# EAGLE design OpenEVSE_PLUS_v2 (EAGLE 6.2)
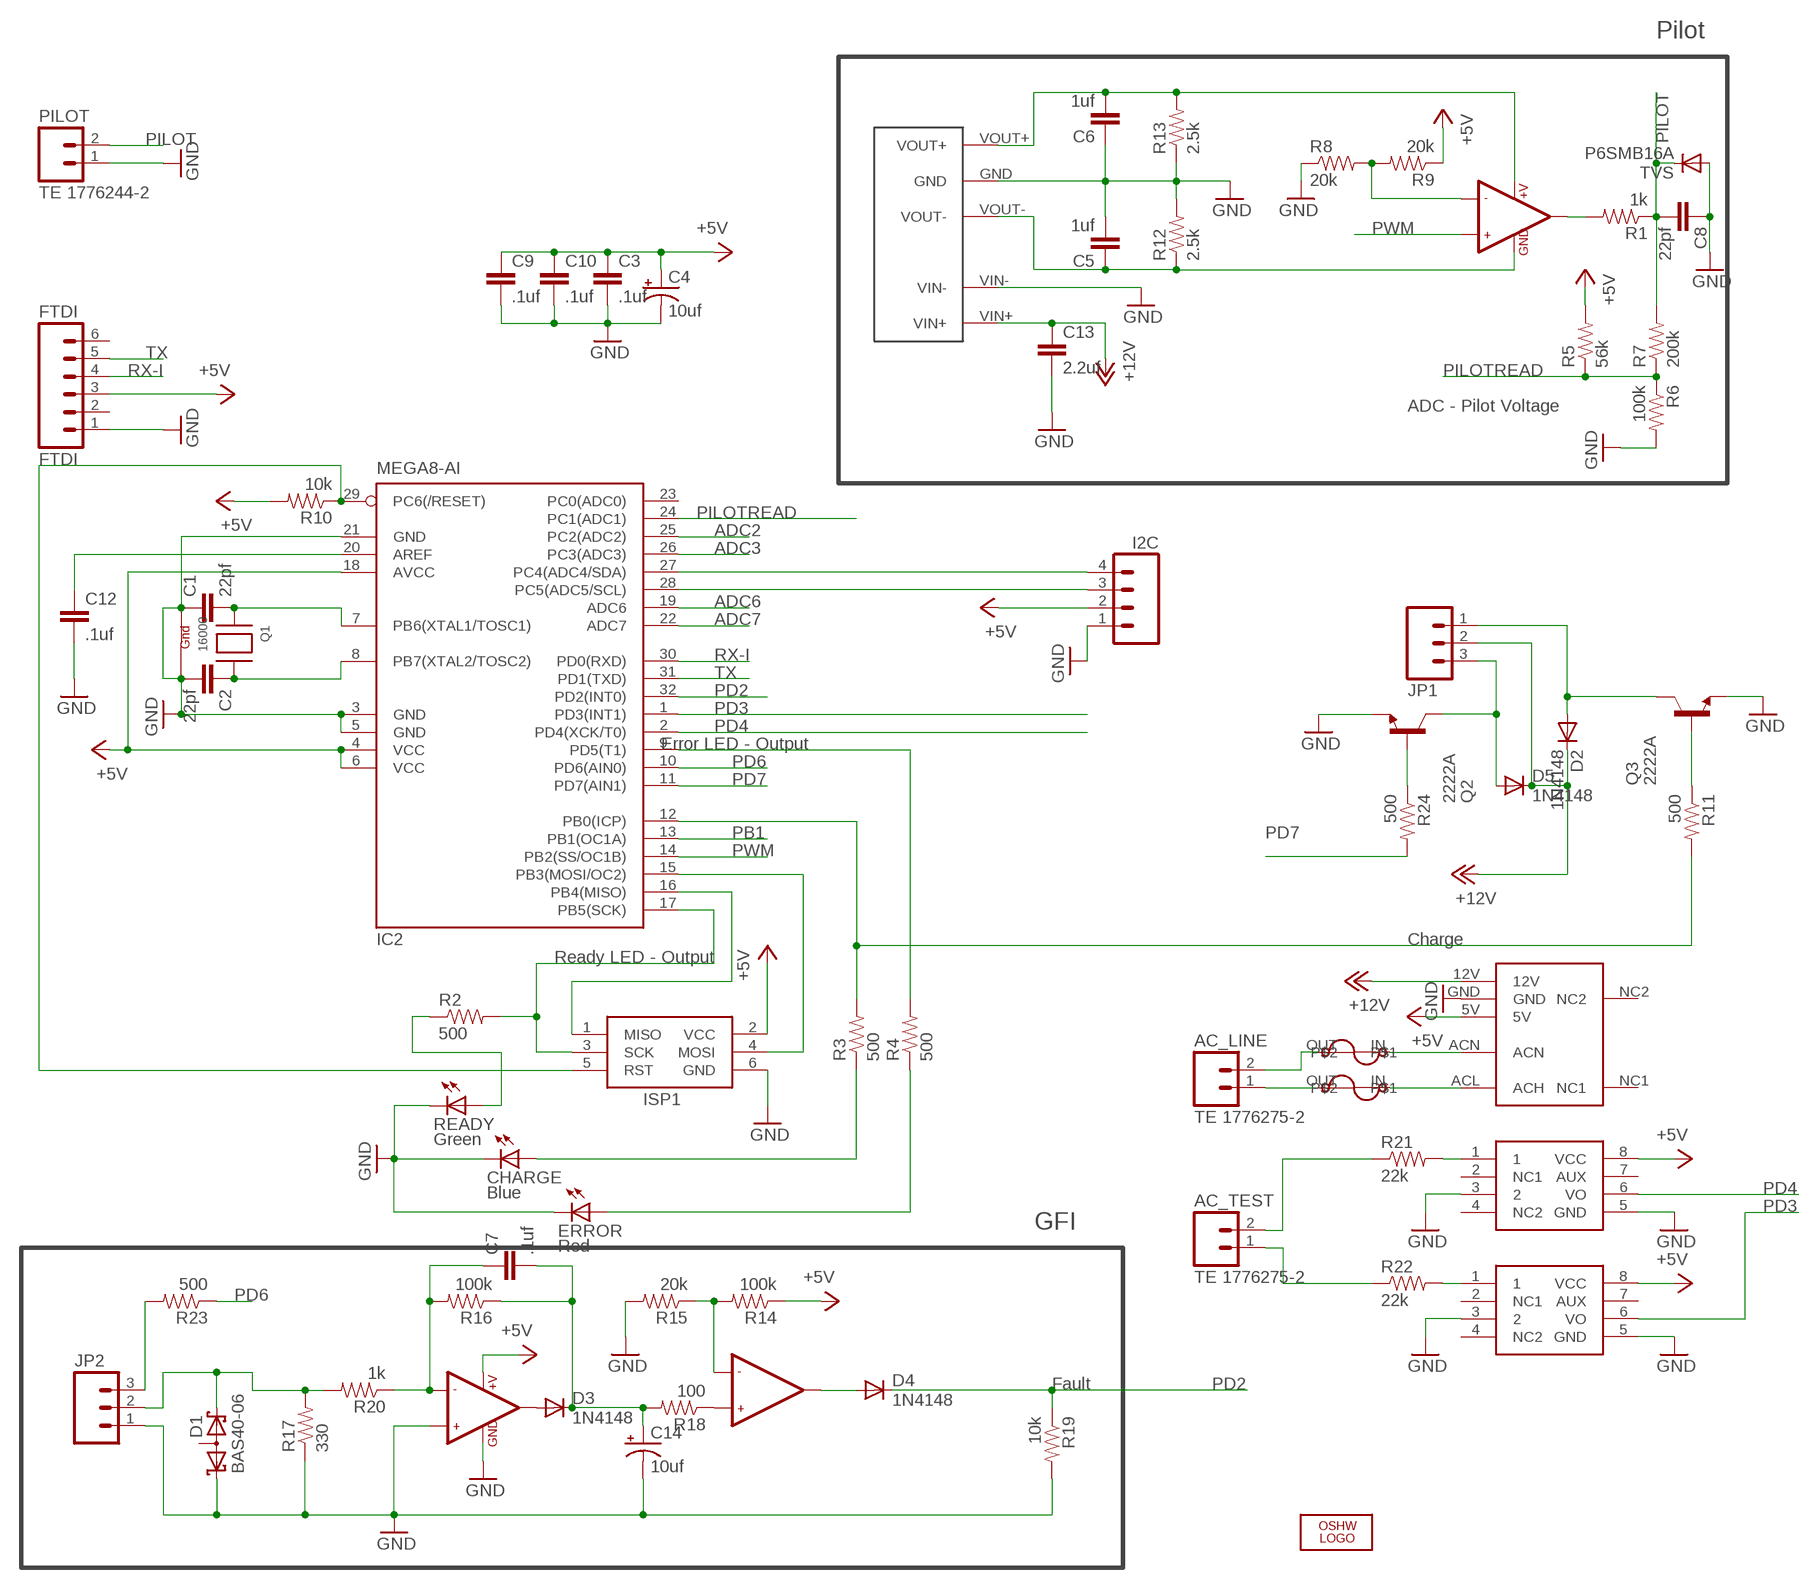
[diagram p0: schematic, sheet 1]

## Parts
AC_LINE  TE 1776275-2  M023.5MM_LOCK  [SCREWTERMINAL-3.5MM-2_LOCK]
AC_TEST  TE 1776275-2  M023.5MM_LOCK  [SCREWTERMINAL-3.5MM-2_LOCK]
C1  22pf  CAP0805  [0805]
C2  22pf  CAP0805  [0805]
C3  .1uf  CAP0805  [0805]
C4  10uf  CAP_POL1206  [EIA3216]
C5  1uf  CAP0805  [0805]
C6  1uf  CAP0805  [0805]
C7  .1uf  CAP0805  [0805]
C8  22pf  CAP0805  [0805]
C9  .1uf  CAP0805  [0805]
C10  .1uf  CAP0805  [0805]
C12  .1uf  CAP0805  [0805]
C13  2.2uf  CAP0805  [0805]
C14  10uf  CAP_POL1206  [EIA3216]
CHARGE  Blue  LED0603  [LED-0603]
D1  BAS40-06  [SOT23]
D2  1N4148  DIODE-SOD123  [SOD123]
D3  1N4148  DIODE-SOD123  [SOD123]
D4  1N4148  DIODE-SOD123  [SOD123]
D5  1N4148  DIODE-SOD123  [SOD123]
DCDC  D107E  DCDC_SIP  [DCDC_SIP]
ERROR  Red  LED0603  [LED-0603]
FTDI  FTDI  M06LOCK  [1X06_LOCK]
I2C  M04LOCK  [1X04_LOCK]
IC1  MID400  [DIP08]
IC2  MEGA8-AI  [TQFP32-08]
IC3  LMV358  [SO08]
IC4  LMV358  [SO08]
IC5  MID400  [DIP08]
ISP1  AVRISP-6  [AVRISP]
JP1  M03SCREW_LOCK  [SCREWTERMINAL-3.5MM-3_LOCK.007S]
JP2  M03LOCK  [1X03_LOCK]
LOGO1  OSHW_LOGO_8MILX0150-NT  [OSHW_8X150_NOTEXT]
PILOT  TE 1776244-2  M025MM  [SCREWTERMINAL-5MM-2]
Q1  16000  XTAL-4-3225  [NX3225]
Q2  2222A  BCX70SMD  [SOT23]
Q3  2222A  BCX70SMD  [SOT23]
R1  1k  RESISTOR0805-RES  [0805]
R2  500  RESISTOR0805-RES  [0805]
R3  500  RESISTOR0805-RES  [0805]
R4  500  RESISTOR0805-RES  [0805]
R5  56k  RESISTOR0805-RES  [0805]
R6  100k  RESISTOR0805-RES  [0805]
R7  200k  RESISTOR0805-RES  [0805]
R8  20k  RESISTOR0805-RES  [0805]
R9  20k  RESISTOR0805-RES  [0805]
R10  10k  RESISTOR0805-RES  [0805]
R11  500  RESISTOR0805-RES  [0805]
R12  2.5k  RESISTOR0805-RES  [0805]
R13  2.5k  RESISTOR0805-RES  [0805]
R14  100k  RESISTOR0805-RES  [0805]
R15  20k  RESISTOR0805-RES  [0805]
R16  100k  RESISTOR0805-RES  [0805]
R17  330  RESISTOR0805-RES  [0805]
R18  100  RESISTOR0805-RES  [0805]
R19  10k  RESISTOR0805-RES  [0805]
R20  1k  RESISTOR0805-RES  [0805]
R21  22k  RESISTORPTH-1/4W  [AXIAL-0.4]
R22  22k  RESISTORPTH-1/4W  [AXIAL-0.4]
R23  500  RESISTOR0805-RES  [0805]
R24  500  RESISTOR0805-RES  [0805]
READY  Green  LED0603  [LED-0603]
TVS  P6SMB16A  DIODE-SMB  [SMB]
U$1  MPM-04E-1205  [MPM-04E-1205]
U$2  BEL1AFUSE  [BELFUSE1A]
U$5  BEL1AFUSE  [BELFUSE1A]

## Nets
12V: C6.2 DCDC.VOUT+ IC4.8(+V) R13.2
+5V: C3.1 C4.A(+) C9.1 C10.1 FTDI.3 I2C.2 IC1.8(VCC) IC2.4(VCC) IC2.6(VCC) IC2.18(AVCC) IC3.8(+V) IC5.8(VCC) ISP1.2(VCC) R5.2 R9.1 R10.2 R14.1 U$1.5V
+12V: C13.1 D2.C D5.C DCDC.VIN+ JP1.2 U$1.12V
-12V: C5.1 DCDC.VOUT- IC4.4(GND) R12.1
ADC2: IC2.25(PC2(ADC2))
ADC3: IC2.26(PC3(ADC3))
ADC6: IC2.19(ADC6)
ADC7: IC2.22(ADC7)
GND: C1.1 C2.2 C3.2 C4.C(-) C5.2 C6.1 C8.1 C9.2 C10.2 C12.2 C13.2 C14.C(-) CHARGE.C D1.1(K1) DCDC.GND DCDC.VIN- ERROR.C FTDI.1 I2C.1 IC1.3 IC1.5(GND) IC2.3(GND) IC2.5(GND) IC2.21(GND) IC3.3(+IN1) IC3.4(GND) IC5.3 IC5.5(GND) ISP1.6(GND) JP2.1 PILOT.1 Q1.1(G1) Q1.3(G2) Q2.2(E) Q3.2(E) R6.2 R8.1 R12.2 R13.1 R15.2 R17.1 R19.2 READY.C TVS.A U$1.GND
N$1: ERROR.A R4.1
N$2: Q3.1(B) R11.1
N$4: C1.2 IC2.7(PB6(XTAL1/TOSC1)) Q1.2(X1)
N$5: C2.1 IC2.8(PB7(XTAL2/TOSC2)) Q1.4(X2)
N$6: CHARGE.A R3.1
N$7: U$1.ACL(ACH) U$2.IN
N$8: C7.1 IC3.2(-IN1) R16.2 R20.1
N$9: U$1.ACN U$5.IN
N$10: IC4.2(-IN1) R8.2 R9.2
N$11: IC4.1(OUT1) R1.2
N$12: AC_LINE.1 U$2.OUT
N$13: AC_LINE.2 U$5.OUT
N$14: IC2.15(PB3(MOSI/OC2)) ISP1.4(MOSI)
N$15: IC2.17(PB5(SCK)) ISP1.3(SCK) R2.2
N$16: IC2.16(PB4(MISO)) ISP1.1(MISO)
N$17: R2.1 READY.A
N$18: IC1.1 R21.P$2
N$19: IC5.1 R22.P$2
N$20: D1.2(K2) JP2.2 R17.2 R20.2
N$21: D3.A IC3.1(OUT1)
N$22: JP2.3 R23.2
N$23: C7.2 C14.A(+) D3.C R16.1 R18.2
N$24: IC3.6(-IN2) R14.2 R15.1
N$25: D4.A IC3.7(OUT2)
N$26: IC3.5(+IN2) R18.1
N$27: D5.A JP1.3 Q2.3(C)
N$28: AC_TEST.2 R21.P$1
N$29: AC_TEST.1 R22.P$1
N$30: Q2.1(B) R24.1
N$34: IC2.12(PB0(ICP)) R3.2 R11.2
N$36: IC2.9(PD5(T1)) R4.2
N$39: I2C.4 IC2.27(PC4(ADC4/SDA))
N$40: I2C.3 IC2.28(PC5(ADC5/SCL))
N$44: C12.1 IC2.20(AREF)
PB1: IC2.13(PB1(OC1A))
PD2: D4.C IC2.32(PD2(INT0)) R19.1
PD3: IC2.1(PD3(INT1)) IC5.6(VO)
PD4: IC1.6(VO) IC2.2(PD4(XCK/T0))
PD6: IC2.10(PD6(AIN0)) R23.1
PD7: IC2.11(PD7(AIN1)) R24.2
PILOT: C8.2 PILOT.2 R1.1 R7.2 TVS.C
PILOTREAD: IC2.24(PC1(ADC1)) R5.1 R6.1 R7.1
PWM: IC2.14(PB2(SS/OC1B)) IC4.3(+IN1)
RELAY: D2.A JP1.1 Q3.3(C)
RST: IC2.29(PC6(/RESET)) ISP1.5(RST) R10.1
RX-I: FTDI.4 IC2.30(PD0(RXD))
TX: FTDI.5 IC2.31(PD1(TXD))
Unconnected: D1.3(AA) FTDI.2 FTDI.6 IC1.2(NC1) IC1.4(NC2) IC1.7(AUX) IC2.23(PC0(ADC0)) IC4.5(+IN2) IC4.6(-IN2) IC4.7(OUT2) IC5.2(NC1) IC5.4(NC2) IC5.7(AUX) U$1.NC1 U$1.NC2

## Notes on the sheet
- Pilot
- ADC - Pilot Voltage
- Error LED - Output
- Charge
- Ready LED - Output
- GFI
- Fault

## Library data of the parts
AC_LINE AC_TEST PILOT = SparkFun:M02: Header 2 Standard 2-pin 0.1" header. Use with straight break away headers (SKU : PRT-00116), right angle break away headers (PRT-00553), swiss pins (PRT-00743), machine pins (PRT-00117), and female headers (PRT-00115). Molex polarized connector foot print use with SKU : PRT-08233 with associated crimp pins and housings.
C1-C3 C5-C10 C12 C13 = SparkFun:CAP: Capacitor Standard 0603 ceramic capacitor, and 0.1" leaded capacitor.
C4 C14 = SparkFun:CAP_POL: Capacitor Polarized These are standard SMD and PTH capacitors. Normally 10uF, 47uF, and 100uF in electrolytic and tantalum varieties. Always verify the external diameter of the through hole cap, it varies with capacity, voltage, and manufacturer. The EIA devices should be standard.
CHARGE ERROR READY = SparkFun:LED: LEDs Standard schematic elements and footprints for 5mm, 3mm, 1206, and 0603 sized LEDs. 5mm - Spark Fun Electronics SKU : COM-00529 (and others)
D1 = diode:BAS40-06: Silicon Schottky Diodes General-purpose diode for high-speed switching
D2-D5 TVS = diode:DIODE-: DIODE
DCDC = Qxd:DCDC_SIP
FTDI = SparkFun:M06: Header 6 Standard 6-pin 0.1" header. Use with straight break away headers (SKU : PRT-00116), right angle break away headers (PRT-00553), swiss pins (PRT-00743), machine pins (PRT-00117), and female headers (PRT-00115). Molex polarized connector foot print use with SKU : PRT-08094 with associated crimp pins and housings. NOTES ON THE VARIANTS LOCK and LOCK_LONGPADS... This footprint was designed to help hold the alignment of a through-hole component (i.e. 6-pin header) while soldering it into place. You may notice that each hole has been shifted either up or down by 0.005 of an inch from it's more standard position (which is a perfectly straight line). This slight alteration caused the pins (the squares in the middle) to touch the edges of the holes. Because they are alternating, it causes a "brace" to hold the component in place. 0.005 has proven to be the perfect amount of "off-center" position when using our standard breakaway headers. Although looks a little odd when you look at the bare footprint, once you have a header in there, the alteration is very hard to notice. Also, if you push a header all the way into place, it is covered up entirely on the bottom side. This idea of altering the position of holes to aid alignment will be further integrated into the Sparkfun Library for other footprints. It can help hold any component with 3 or more connection pins.
I2C = SparkFun:M04: Header 4 Standard 4-pin 0.1" header. Use with straight break away headers (SKU : PRT-00116), right angle break away headers (PRT-00553), swiss pins (PRT-00743), machine pins (PRT-00117), and female headers (PRT-00115). Molex polarized connector foot print use with SKU : PRT-08231 with associated crimp pins and housings.
IC1 IC5 = SparkFun:MID400
IC2 = atmel:MEGA8: MICROCONTROLLER 8 Kbytes FLASH, 1 kbytes SRAM, 512 bytes EEPROM, USART, 6-channel 10 bit ADC, 2-channel 8 bit ADC Pin compatible with Atmega48, ATMega88, ATMega168 Source: avr.lbr; MPN: ATMEGA8-16AU; OC_FARNELL: 9171371; OC_NEWARK: 73M8863
IC3 IC4 = SparkFun:LMV358
ISP1 = adafruit:AVRISP: AVR ISP HEADER Standard 6 pin header for AVR programming
JP1 JP2 = SparkFun:M03: Header 3 Standard 3-pin 0.1" header. Use with straight break away headers (SKU : PRT-00116), right angle break away headers (PRT-00553), swiss pins (PRT-00743), machine pins (PRT-00117), and female headers (PRT-00115). Molex polarized connector foot print use with SKU : PRT-08232 with associated crimp pins and housings.
LOGO1 = ohw-logo:OSHW_LOGO_8MIL
Q1 = adafruit:XTAL-4: Classic 4-pin 3.2 x 2.5mm crystal
Q2 Q3 = transistor-npn:BCX70*: NPN Transistor
R1-R24 = SparkFun:RESISTOR: Resistor Basic schematic elements and footprints for 0603, 1206, and PTH resistors.
U$1 = Qxd:MPM-04E-1205
U$2 U$5 = Qxd:BEL1AFUSE

## Board
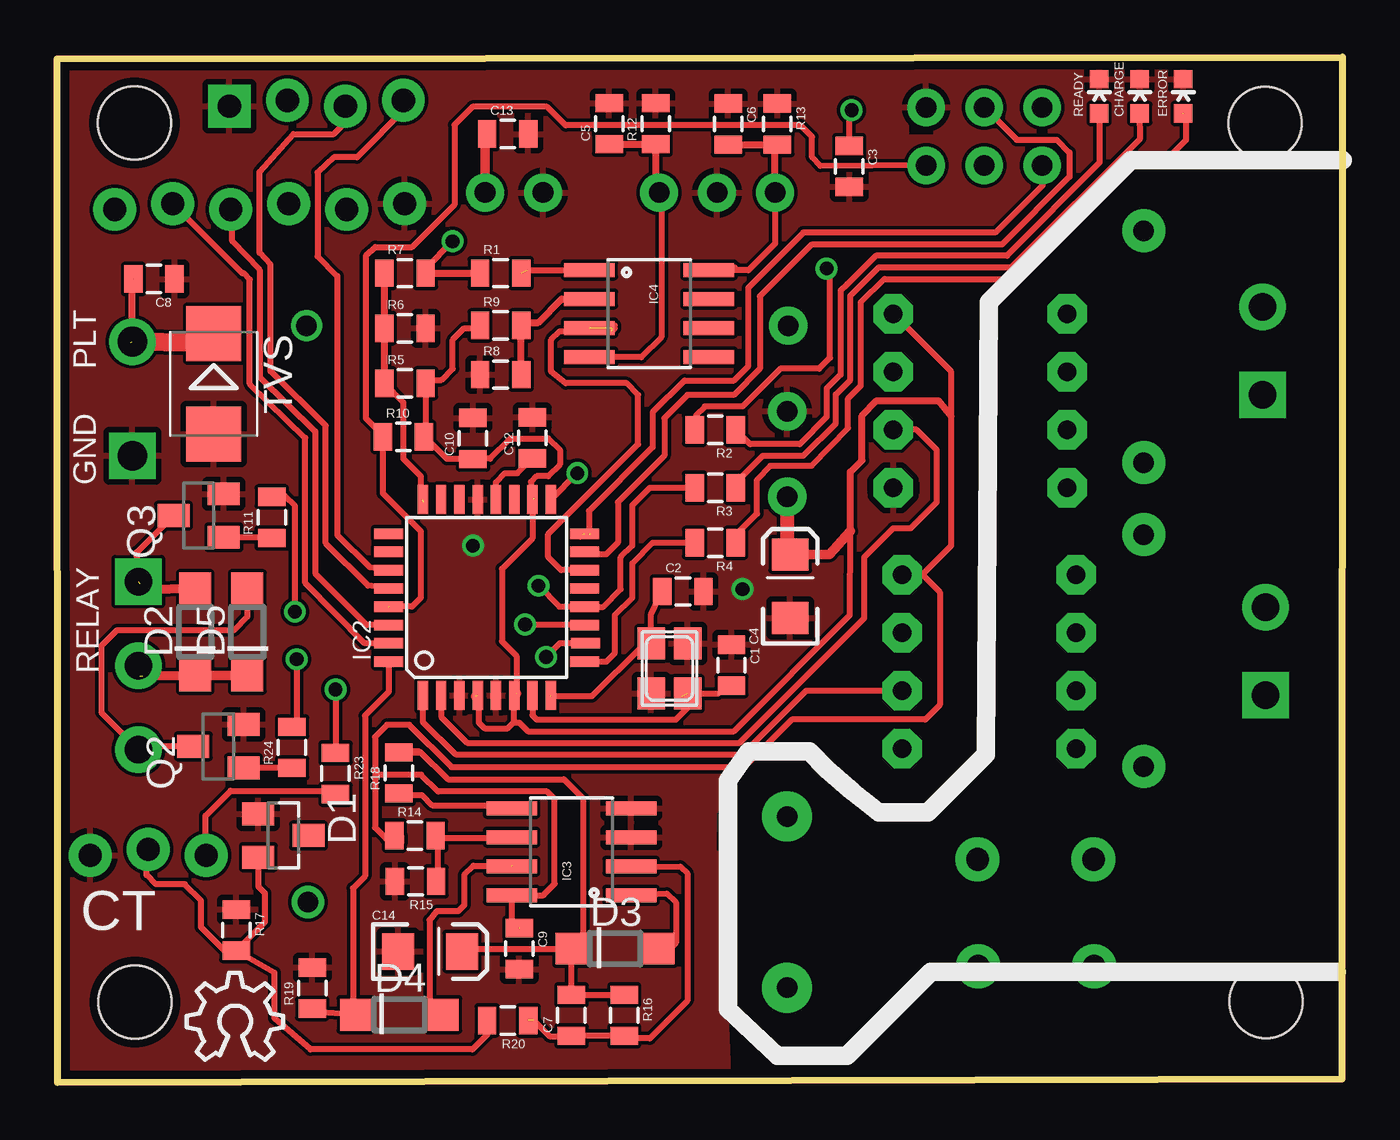
[diagram p1: board, top side]
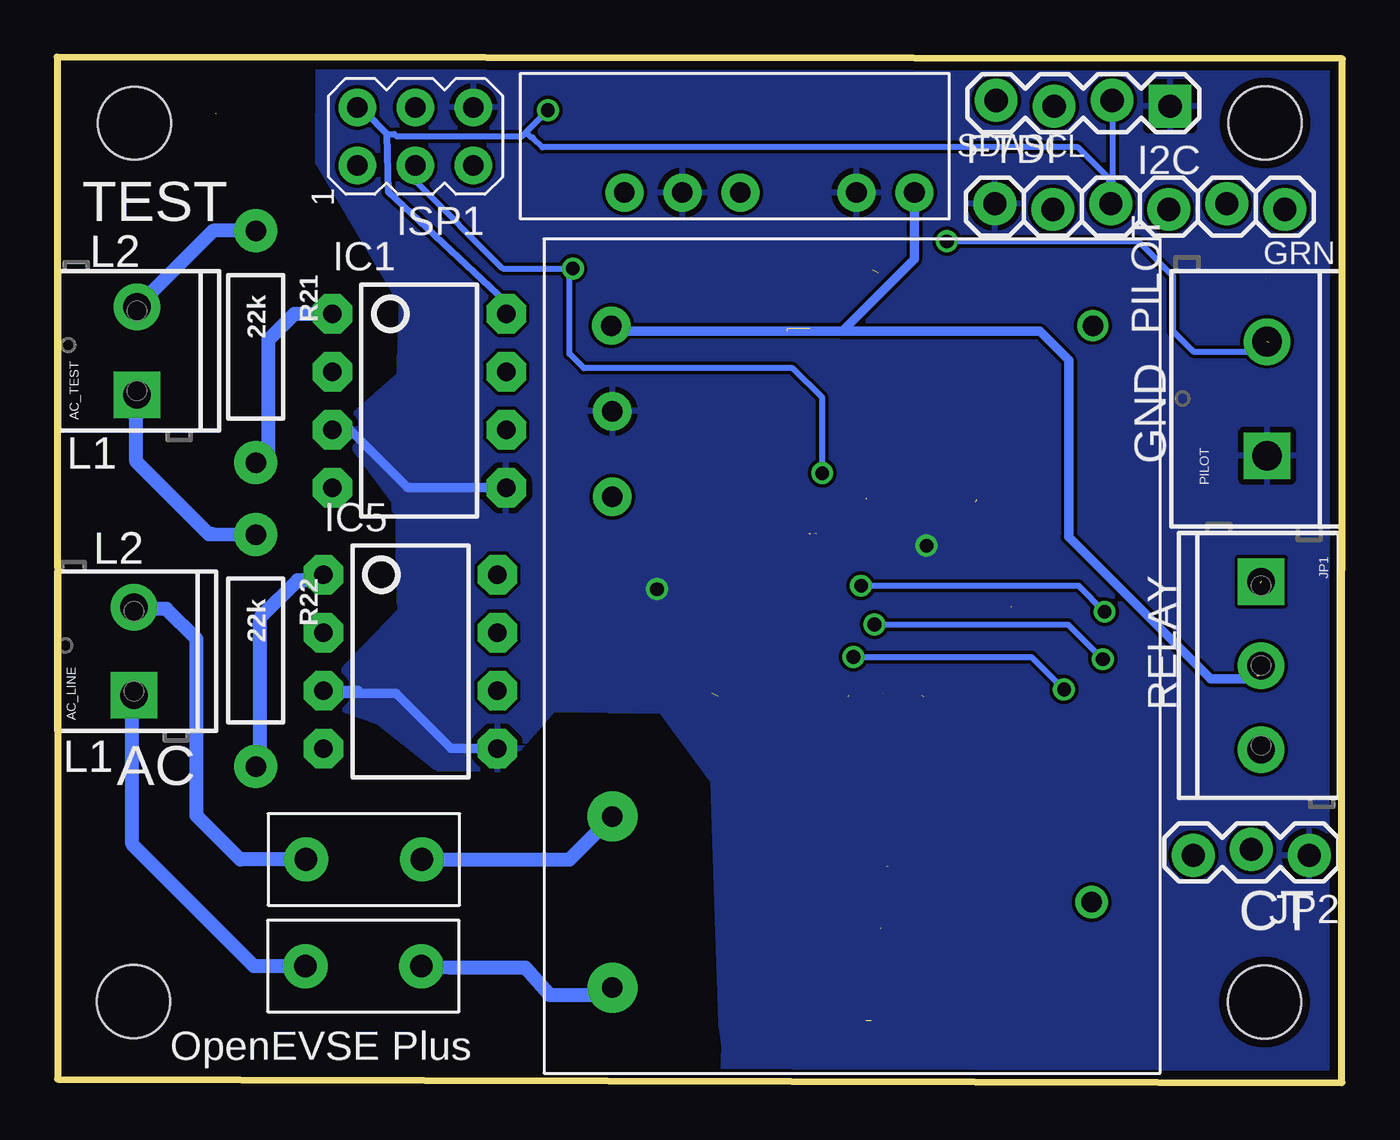
[diagram p2: board, bottom side, seen from below]

Size 56.31 x 44.93 mm. Coordinates in mm from the lower left corner, seen from the top.
Outline: 56.31,44.93 56.28,0.15 0.02,0 0,44.85 56.31,44.93
Copper layers (1*16): Top 0.0356mm / dielectric 1.5011mm / Bottom 0.0356mm
Design rules: minimum track width 6mil, minimum drill 13mil, track to track 6mil, track to pad 6mil, pad to pad 6mil, via to via 6mil, smd to smd 6mil, copper to edge 15mil, drill to drill 6mil, minimum pad ring 7mil, minimum via ring 7mil, stop-mask expansion 4mil, vias tented up to drill 0mil, thermal gap 10mil
Holes 3.2 mm at 52.91,42.03 52.97,3.55 3.41,3.53 3.38,42.04
tRestrict: area 35.5,25.8 to 36.4,26.4; area 36.9,25.8 to 37.8,26.3; area 37.3,41.6 to 38.4,42.3
bRestrict: area 35.5,25.7 to 36.3,26.3; area 37,25.6 to 37.8,26.3; area 37.6,41.5 to 38.7,42.3

### Footprints (pad centres in the part's own frame; a part is rotated, then mirrored left to right if it is on the bottom)
SCREWTERMINAL-3.5MM-2_LOCK = drill 1.2 pad 2.032 square: 1 -0.178,0 | drill 1.2 pad 2.032: 2 3.678,0
0805 = smd 0.8 x 1.2: 1 -0.9,0; 2 0.9,0
EIA3216 = smd 1.4 x 1.6: A 1.4,0; C -1.4,0
LED-0603 = smd 0.8 x 0.8: A 0,-0.75; C 0,0.75
SOT23 = smd 1 x 1.4: 1 -0.95,-1.1; 2 0.95,-1.1; 3 0,1.1
SOD123 = smd 1.4 x 1.4: A 1.9,0; C -1.9,0
DCDC_SIP = drill 0.9 pad 1.676: GND 10.16,0; VIN+ 0,0; VIN- 2.54,0; VOUT+ 12.7,0; VOUT- 7.62,0
1X06_LOCK = drill 1.016 pad 1.88: 1 0,0; 2 2.54,-0.254; 3 5.08,0; 4 7.62,-0.254; 5 10.16,0; 6 12.7,-0.254
1X04_LOCK = drill 1.016 pad 1.88 square: 1 0,0.127 | drill 1.016 pad 1.88: 2 2.54,-0.127; 3 5.08,0.127; 4 7.62,-0.127
DIP08 = drill 0.813 pad 1.727 octagon: 1 -3.81,-3.81; 2 -1.27,-3.81; 3 1.27,-3.81; 4 3.81,-3.81; 5 3.81,3.81; 6 1.27,3.81; 7 -1.27,3.81; 8 -3.81,3.81
TQFP32-08 = smd 1.27 x 0.457: 1 -4.293,2.8; 2 -4.293,2; 3 -4.293,1.2; 4 -4.293,0.4; 5 -4.293,-0.4; 6 -4.293,-1.2; 7 -4.293,-2; 8 -4.293,-2.8; 17 4.293,-2.8; 18 4.293,-2; 19 4.293,-1.2; 20 4.293,-0.4; 21 4.293,0.4; 22 4.293,1.2; 23 4.293,2; 24 4.293,2.8 | smd 0.457 x 1.27: 9 -2.8,-4.293; 10 -2,-4.318; 11 -1.2,-4.293; 12 -0.4,-4.293; 13 0.4,-4.293; 14 1.2,-4.293; 15 2,-4.293; 16 2.8,-4.293; 25 2.8,4.293; 26 2,4.293; 27 1.2,4.293; 28 0.4,4.293; 29 -0.4,4.293; 30 -1.2,4.293; 31 -2,4.293; 32 -2.8,4.293
SO08 = smd 0.61 x 2.21: 1 -1.905,-2.616; 2 -0.635,-2.616; 3 0.635,-2.616; 4 1.905,-2.616; 5 1.905,2.616; 6 0.635,2.616; 7 -0.635,2.616; 8 -1.905,2.616
AVRISP = drill 0.9 pad 1.626: 1 -1.27,2.54; 2 1.27,2.54; 3 -1.27,0; 4 1.27,0; 5 -1.27,-2.54; 6 1.27,-2.54
SCREWTERMINAL-3.5MM-3_LOCK.007S = drill 1.2 pad 2.032 square: 1 -0.178,0 | drill 1.2 pad 2.032: 2 3.5,0; 3 7.178,0
1X03_LOCK = drill 1.016 pad 1.88: 1 0,0.127; 2 2.54,-0.127; 3 5.08,0.127
SCREWTERMINAL-5MM-2 = drill 1.3 pad 2.032 square: 1 0,0 | drill 1.3 pad 2.032: 2 5,0
NX3225 = smd 1.4 x 1.2: 1 -1.1,0.8; 2 1.1,0.8; 3 1.1,-0.8; 4 -1.1,-0.8
AXIAL-0.4 = drill 0.9 pad 1.88: P$1 -5.08,0; P$2 5.08,0
SMB = smd 2.4 x 2.4: A 2.2,0; C -2.2,0
MPM-04E-1205 = drill 0.9 pad 1.676: 5V 3,25.25; 12V 2.95,32.75; GND 3,29 | drill 0.9 pad 2.184: ACL 3,3.75; ACN 3,11.25 | drill 0.9 pad 1.422: NC1 24,7.5 | drill 0.9: NC2 24.05,32.75
BELFUSE1A = drill 1 pad 1.93: IN 2,1.66; OUT 2,6.74

### Placement (x,y rotation side)
AC_LINE  52.94,17.15 90 bottom
AC_TEST  52.81,30.3 90 bottom
C1  29.55,18.28 270 top
C2  27.42,21.52 0 top
C3  34.7,40.14 270 top
C4  32.12,21.74 90 top
C5  24.19,42.01 90 top
C6  29.39,41.99 270 top
C7  22.54,2.95 90 top
C8  4.25,35.21 180 top
C9  20.25,5.87 270 top
C10  18.22,28.22 90 top
C12  20.82,28.25 90 top
C13  19.74,41.56 0 top
C14  16.34,5.74 0 top
CHARGE  47.43,43.21 0 top
D1  9.91,10.82 270 top
D2  6.05,19.74 90 top
D3  24.44,5.87 0 top
D4  14.99,2.97 0 top
D5  8.34,19.74 90 top
DCDC  18.75,38.99 180 bottom
ERROR  49.33,43.21 0 top
FTDI  15.22,38.51 0 bottom
I2C  7.55,42.9 180 bottom
IC1  40.44,29.87 270 bottom
IC2  18.82,21.25 90 top
IC3  22.54,10.11 90 top
IC4  25.93,33.69 270 top
IC5  40.82,18.44 270 bottom
ISP1  40.61,41.45 90 bottom
JP1  3.56,21.77 270 bottom
JP2  1.45,10.09 180 bottom
LOGO1  5.67,0.99 0 top
PILOT  3.3,27.46 90 bottom
Q1  26.83,18.14 270 top
Q2  7.07,14.73 90 top
Q3  6.2,24.84 90 top
R1  19.43,35.46 0 top
R2  28.83,28.6 180 top
R3  28.83,26.06 180 top
R4  28.83,23.65 180 top
R5  15.24,30.63 0 top
R6  15.24,33.05 0 top
R7  15.24,35.46 0 top
R8  19.43,31.02 0 top
R9  19.43,33.17 0 top
R10  15.17,28.29 0 top
R11  9.4,24.76 90 top
R12  26.22,42.01 90 top
R13  31.55,41.99 270 top
R14  15.68,10.82 0 top
R15  15.7,8.82 180 top
R16  24.85,2.95 270 top
R17  7.85,6.68 270 top
R18  14.97,13.57 90 top
R19  11.18,4.14 90 top
R20  19.74,2.72 180 top
R21  47.6,32.23 270 bottom
R22  47.6,18.92 270 bottom
R23  12.2,13.54 270 top
R24  10.29,14.68 90 top
READY  45.65,43.21 0 top
TVS  6.86,30.61 270 top
U$1  34.98,0.41 0 bottom
U$2  38.69,3.1 90 bottom
U$5  38.66,7.77 90 bottom

### Tracks (layer width: path | path; a pad name or v marks a point on that pad's centre or on a via)
12V
  Top 0.254: 29.68,35.71 IC4.8 28.81,35.59 30.28,35.59 31.45,36.76 DCDC.VOUT+ | 31.45,41.15 31.49,41.15 R13.2
  Top 0.305: DCDC.VOUT+ 31.45,41.15 31.42,41.18 | C6.2 R13.2
+5V  (via drill 0.6)  (4 unrouted)
  Top 0.254: 20.88,25.6 IC2.18 20.82,23.84 19.49,22.51 19.49,19.33 20.12,18.7 20.12,16.85 | IC1.8 36.76,33.81 | 15.01,10.53 R14.1 14.8,10.67 14.41,10.69 13.92,11.18 13.92,13.67 | 37.9,22.25 39.17,23.52 39.17,29.19 39.17,31.14 IC1.8 | 18.47,16.79 18.47,15.77 18.72,15.52 19.74,15.52 19.99,15.77 | 34.75,24.16 34.73,20.47 29.65,15.39 20.63,15.39 20.25,15.77 19.99,15.77 | 36.63,33.81 36.52,33.7 36.53,33.68 IC1.8 | 19.99,16.92 19.99,15.77 | C9.1 19.92,7.09 IC3.8 21.32,8.21 21.32,8.23 21.8,8.71 21.8,12.42 21.47,12.75 16.69,12.75 15.96,13.49 14.1,13.49 13.92,13.67 | 16.14,28.3 R5.2 16.14,30.78 16.84,30.78 17.33,31.27 17.33,32.54 17.84,33.05 18.6,33.05 18.6,33.11 R9.1 | 16.14,28.3 16.06,28.22 16.06,28.28 R10.2 | 16.14,28.3 16.14,28.27 17.07,27.33 18.34,27.33 | 20.88,25.55 20.76,25.68 20.76,26.32 21.01,26.57 21.52,26.57 22.03,27.08 22.03,27.71 21.52,28.22 19.87,28.22 18.98,27.33 18.34,27.33 | 18.34,27.33 18.22,27.21 C10.1 | 20.12,16.54 20.12,16.85 | 20.12,16.85 IC2.6 | IC5.8 37.9,22.25 | 37.9,22.25 38.66,21.49 38.66,16.54 38.03,15.9 32.19,15.9 30.1,13.82 17.28,13.82 15.42,15.67 14.46,15.67 13.92,15.14 13.92,13.67 | 32.06,23.14 C4.A | 42.93,42.45 42.93,42.53 ISP1.2 | C3.1 34.7,42.19 v34.8,42.6
  Top 0.305: IC2.6 20.07,16.91 | 42.93,42.95 42.93,42.45 | 34.75,24.16 34.75,26.75 35.26,27.26 35.26,29.21 35.9,29.87 38.61,29.87 39.17,29.19
  Top 0.406: IC2.6 20.12,17.05 | 20.12,17.05 19.99,16.92 | 18.34,16.92 18.47,16.79 | 15.01,10.53 15.01,10.79 | 32.06,23.14 33.84,23.14 34.75,24.16
  Top 0.61: U$1.5V 31.98,23.22 32.06,23.14
  Bottom 0.254: 10.22,38.38 10.22,38.44 | 10.22,38.44 FTDI.3 10.09,38.56 I2C.2 | ISP1.2 42.91,42.54 42.88,42.57 | 41.84,41.56 41.53,41.56 41.43,41.45 35.95,41.45 35.77,41.63 | 35.77,41.63 v34.8,42.6 | 35.77,41.63 35.53,41.4 35.47,41.4 35.04,40.97 11.59,40.97 10.22,39.6 10.22,38.44
  Bottom 0.305: IC1.8 36.63,34.19 41.79,39.02 41.84,41.56 42.78,42.5 42.88,42.57 42.93,42.57 | FTDI.3 10.14,39.45
+12V  (1 unrouted)
  Top 0.254: C13.1 18.84,41.47 18.75,41.38
  Top 0.406: 3.75,17.81 D2.C D5.C | DCDC.VIN+ 18.75,41.38 18.75,41.71 18.85,41.81
  Bottom 0.406: DCDC.VIN+ 18.75,36.07 21.9,32.92 | 21.9,32.92 31.79,32.92 U$1.12V | 21.9,32.92 13.26,32.92 11.99,31.65 11.99,23.9 5.77,17.68 3.74,17.68 3.61,17.81 3.61,18.12 JP1.2
-12V
  Top 0.254: 26.47,38.89 26.47,32.67 25.58,31.78 23.58,31.78 IC4.4 | 26.15,41.11 R12.1
  Top 0.305: C5.1 26.15,41.11 26.22,41.18 R12.1 26.22,39.14 26.32,39.04 DCDC.VOUT- 26.47,38.89
GND  (via drill 0.6)
  Top 0.254: C14.C 15.32,5.34
  Bottom 0.254: IC1.3 44.38,28.6
  Bottom 0.406: 44.38,28.6 44.51,28.73 | IC1.5 40.95,26.06 43.49,28.6 IC1.3 44.38,28.73 | IC5.5 39.05,14.63 41.46,17.05 44.51,17.05 IC5.3 43.11,17.17
  other vias: 30.03,21.62 18.22,23.52
  pour Top: 0.03,44.99 3.28,45.1 44.98,44.95 47.4,40.21 44.79,37.31 40.61,33.14 34.87,20.29 26.03,10.04 28.98,10.06 29.39,0.43 24.17,0.05 0.06,0.03 -0.04,25.13 0.03,28.74
  pour Bottom: 0.31,45.05 44.88,44.59 44.89,40.31 41.2,34.11 41.33,30.96 43.95,28.68 41.53,25.48 41.53,25.07 41.36,25.07 41.36,22.4 41.28,20.65 44.99,16.82 42.25,15.83 39.68,13.79 38.87,13.79 36.89,13.72 34.56,16.37 29.84,16.28 27.56,13.21 27.23,2.54 27.1,1.7 27.13,0.13 23.21,0.16 17.1,0.06 6.75,-0.24 -0.23,0.16
  pour Top: -0.1,45.12 3.16,45.23 49.4,44.49 49.2,40.74 44.99,40.44 41.17,33.47 39.07,24.61 30.35,15.78 28.78,11.79 28.63,0.41 26.14,0.27 24.04,0.18 -0.07,0.16 -0.16,28.18 -0.1,28.87
N$1  (1 unrouted)
  Top 0.254: R4.1 29.73,23.98 30.66,24.92 30.66,26.42 31.25,27.03 33.05,27.03 34.65,28.68 34.65,29.97 35.21,30.53 35.21,34.19 36.25,35.21 41.99,35.21 47.2,40.41 48.57,40.41 49.46,41.3 49.46,42.32 49.33,42.45
N$2
  Top 0.254: Q3.1 9.37,23.89 R11.1
N$4  (1 unrouted)
  Top 0.254: Q1.2 28.94,17.04 C1.2 | IC2.7 20.82,16.09 21.01,15.9 27.11,15.9 27.61,16.41 27.61,16.66 27.36,16.92
N$5  (1 unrouted)
  Top 0.254: Q1.4 26.03,20.54 26.34,21.24 26.34,21.34 C2.1 | Q1.4 26.12,19.11 | Q1.4 25.62,19.11 23.42,16.92 21.65,16.92
N$6
  Top 0.254: R3.1 29.73,26.27 30.92,27.46 32.7,27.46 34.12,28.88 34.12,30.15 34.75,30.79 34.75,34.47 36,35.71 41.81,35.71 47.45,41.35 CHARGE.A
N$7
  Bottom 0.254: 31.93,4.09 31.93,4.11 U$1.ACL
  Bottom 0.61: 31.93,4.09 32.19,3.84 34.73,3.84 35.79,5.03 39.12,5.03 U$2.IN
N$8  (1 unrouted)
  Top 0.254: C7.1 R16.2 24.82,2.02 24.82,1.93 25.96,1.93 27.61,3.58 27.61,9.17 27.31,9.45 IC3.2 | 22.49,2.01 C7.1 | 20.88,2.72 21.57,2.03 22.52,2.03 C7.1
N$9
  Bottom 0.61: U$5.IN 33.87,9.77 U$1.ACN
N$10
  Top 0.305: 20.08,30.63 R8.2 R9.2 20.2,33.3 21.08,33.3 22.11,34.33 IC4.2
N$11  (1 unrouted)
  Top 0.254: 20.59,35.6 IC4.1
N$12
  Bottom 0.61: U$2.OUT 47.67,5.1 53.02,10.44 53.02,16.89 AC_LINE.1
N$13
  Bottom 0.61: U$5.OUT 48.28,9.77 50.2,11.69 50.2,19.43 51.52,20.75 52.87,20.75 AC_LINE.2
N$14
  Top 0.254: 40.37,42.57 40.77,42.57 42.04,41.3 43.8,41.3 44.35,40.74 44.35,39.68 41.41,36.73 33.08,36.73 30.79,34.44 30.79,31.27 29.65,30.13 27.61,30.13 26.6,29.11 26.6,27.46 24.57,25.43 24.57,23.65 24.06,23.14 23.22,23.14 IC2.15 23.14,23.27 | 40.37,42.57 40.26,42.57 | ISP1.4 40.38,42.56 40.37,42.57
N$15  (via drill 0.6)
  Top 0.254: R2.2 28,28.67 28,29.24 28.38,29.62 30.03,29.62 31.68,31.27 33.38,31.27 33.86,31.75 33.86,35.51 v33.71,35.66 | IC2.17 21.63,25.54 v22.79,26.7
  Bottom 0.254: ISP1.3 40.64,39.46 40.59,39.46 36.78,35.66 v33.71,35.66 33.86,35.51 33.86,31.93 33.23,31.29 24.08,31.29 22.79,30 v22.79,26.7
N$16  (2 unrouted)
  Top 0.254: IC2.16 23.24,24.16 23.37,24.03 | ISP1.1 43.18,39.31 41.1,37.24 32.7,37.24 30.28,34.83 30.28,31.4 29.65,30.76 27.49,30.76 26.09,29.36 26.09,27.84 23.3,25.05 23.3,24.03 | 23.04,24.03 22.92,23.9
N$17
  Top 0.254: 34.61,34.99 35.87,36.22 41.61,36.22 45.67,40.31 45.67,42.43 READY.A | 34.61,34.99 34.32,34.7 | R2.1 30.36,27.97 32.54,27.97 33.71,29.16 33.71,30.41 34.32,31.02 34.32,34.69 34.61,34.99
N$18
  Bottom 0.61: R21.P$2 47.05,27.59 47.05,32.54 45.9,33.68 IC1.1
N$19
  Bottom 0.254: 47.43,13.74 47.3,13.74 R22.P$2
  Bottom 0.61: IC5.1 44.51,22 45.78,22 47.43,20.35 47.43,13.74
N$20
  Top 0.254: R20.2 18.84,2.1 18.19,1.45 11.11,1.45 9.53,2.82 9.53,4.82 R17.2 | R17.2 7.33,5.78 6.3,6.81 6.3,7.98 5.59,8.69 4.32,8.69 3.92,9.09 3.92,10.19 JP2.2 | D1.2 8.81,8.59 9.1,8.31 9.1,7.03 R17.2
N$21
  Top 0.254: IC3.1 26.7,8.28 27.11,7.9 27.11,6.12 26.73,5.74 26.47,5.74 | 26.47,5.74 25.96,5.74 | 26.47,5.74 D3.A
N$22
  Top 0.254: JP2.3 6.51,11.69 7.6,12.78 12.06,12.78 R23.2
N$23
  Top 0.254: 24.82,4.09 25.07,3.84 25.07,3.71 24.94,3.85 R16.1 C7.2 22.54,5.49 D3.C | 15.84,14.46 R18.2 14.88,14.46 14.84,14.5 | C14.A 17.84,5.74 17.96,5.87 22.41,5.87 | 22.41,5.87 22.54,5.74 | 22.41,5.87 D3.C | D3.C 22.41,5.74 23.04,6.12 23.04,12.45 22.2,13.29 17.12,13.29 15.88,14.5 15.55,14.5 15.42,14.38 15.3,14.5 14.84,14.5 | 14.84,14.5 14.79,14.5
N$24
  Top 0.254: 16.69,8.5 16.69,8.79 | 16.69,8.79 16.69,10.61 R14.2 16.74,10.72 19.79,10.72 IC3.6 | R15.1 16.67,8.81 16.69,8.79
  Top 0.406: R14.2 16.72,10.72 16.69,10.69
N$25  (1 unrouted)
  Top 0.254: D4.A 16.31,3.5 16.31,7.11 16.64,7.52 17.58,7.52 17.84,7.77 17.84,9.09 18.24,9.5 19.94,9.5
N$26
  Top 0.254: IC3.5 19.79,12.14 16.44,12.14 15.98,12.6 15.03,12.6 R18.1
N$27
  Top 0.254: Q2.3 3.65,14.73 JP1.3 1.94,16.22 1.94,19.13 2.62,19.81 7.75,19.81 8.34,20.4 D5.A
N$28
  Bottom 0.61: R21.P$1 49.48,37.31 AC_TEST.2
N$29
  Bottom 0.61: R22.P$1 49.46,24.03 49.66,24.03 52.84,27.21 52.84,30.1 AC_TEST.1
N$30
  Top 0.254: R24.1 Q2.1
N$34  (via drill 0.6)
  Top 0.254: R3.2 25.96,26.06 25.2,25.3 25.2,23.52 24.69,23.01 24.69,21.62 23.92,20.85 IC2.12 22.01,20.85 v21.09,21.77 | v10.42,20.63 10.42,25.28 9.99,25.71 9.45,25.71 R11.2
  Bottom 0.254: v21.09,21.77 11.56,21.77 v10.42,20.63
N$36
  Top 0.254: IC2.9 24.06,18.45 24.44,18.82 24.44,20.47 25.2,21.24 25.2,22.76 26.09,23.65 R4.2
N$39
  Top 0.254: IC2.27 13.71,22.57 12.27,23.98 12.27,35.33 11.41,36.2 11.41,39.88 12.12,40.54 13.14,40.54 15.3,42.7 I2C.4
N$40
  Top 0.254: IC2.28 13.62,21.77 11.77,23.62 11.77,28.78 9.35,31.17 9.35,35.84 8.87,36.35 8.87,39.91 10.34,41.56 12.12,41.56 12.76,42.19 I2C.3
N$44
  Top 0.254: IC2.20 19.22,26.31 19.61,26.7 20.17,26.7 C12.1
PD2
  Top 0.254: D4.C 11.51,3.08 11.18,3.25 | 11.18,3.25 11.11,3.33 | R19.1 11.18,3.25 | IC2.32 14.53,17.12 13.49,16.08 13.49,9.04 12.96,8.51 12.96,2.93 D4.C | 13.49,2.97 D4.C
PD3
  Top 0.254: IC2.1 16.02,15.81 17.45,14.38 30.03,14.38 32.82,17.17 36.89,17.17 36.95,17.24 | 36.95,17.24 37.01,17.3 | IC5.6 36.95,17.24
PD4
  Top 0.254: IC2.2 16.82,16.03 17.96,14.89 29.9,14.89 35.36,20.35 35.36,23.01 36.63,24.28 37.39,24.28 38.54,25.43 38.54,27.71 37.65,28.6 IC1.6
PD6  (via drill 0.6)
  Top 0.254: IC2.10 22.02,19.25 v21.42,18.64 | v12.2,17.22 R23.1
  Bottom 0.254: v21.42,18.64 13.62,18.64 v12.2,17.22
PD7  (via drill 0.6)
  Top 0.254: IC2.11 20.53,20.05 v20.5,20.07 | v10.5,18.54 10.5,15.79 R24.2
  Bottom 0.254: v20.5,20.07 12.02,20.07 v10.5,18.54
PILOT  (via drill 0.6)  (2 unrouted)
  Top 0.254: R7.2 16.14,35.67 v17.33,36.86
  Top 0.305: R7.2 R1.1 | PILOT.2 3.3,35.15 C8.2
  Top 0.406: 16.18,35.63 R7.2
  Top 0.813: TVS.C 6.04,32.43 PILOT.2
  Bottom 0.254: v17.33,36.86 8.95,36.86 7.42,35.33 7.42,32.92 6.53,32.03 3.61,32.03 3.23,32.41
PILOTREAD  (1 unrouted)
  Top 0.254: 16.06,25.43 15.93,25.43 15.93,26.57 15.17,27.33 15.17,29.8 R5.1
  Top 0.305: R7.1 R6.1 R5.1
PWM  (2 unrouted)
  Top 0.254: 24.44,33.05 24.31,32.92 22.03,32.92 21.65,32.54 21.65,31.14 22.28,30.63 24.95,30.63 25.46,30.13 25.46,27.97 21.52,24.03 21.52,23.01 22.09,22.45 IC2.14 | 24.44,33.17 24.31,33.05
RELAY  (1 unrouted)
  Top 0.254: 3.74,21.74 3.76,21.72 | JP1.1 3.48,23.23 Q3.3
  Top 0.406: D2.A 3.87,21.61 3.87,21.62 | 3.61,21.87 3.76,21.72 3.87,21.62 | 3.87,21.62 3.87,21.74 3.74,21.87
RST  (1 unrouted)
  Top 0.254: ISP1.5 33.44,40.16 33.08,40.54 33.08,41.43 32.57,41.94 22.28,41.94 21.47,42.75 18.19,42.75 17.4,41.96 17.4,38.46 15.55,36.6 13.95,36.6 13.52,36.22 13.52,29.11 14.28,28.35 14.27,28.34 R10.1 14.28,28.28 14.28,25.81 15.93,24.16 15.93,21.24 15.55,20.86 IC2.29
RX-I
  Top 0.254: IC2.30 13.57,20.05 11.31,22.3 11.31,28.53 8.87,30.91 8.87,35.61 7.68,36.86 7.68,38.18 FTDI.4
TX
  Top 0.254: IC2.31 13.48,19.25 10.88,21.9 10.88,28.25 8.44,30.61 8.44,35.18 8.18,35.46 8.11,35.46 FTDI.5

### Text on the board
tNames: PLT | GND | _ | _ | RELAY | CT | _ | _
bNames: SCL | SDA | TEST | GRN | L2 | PILOT | GND | L1 | L2 | RELAY | L1 | AC | CT | OpenEVSE Plus